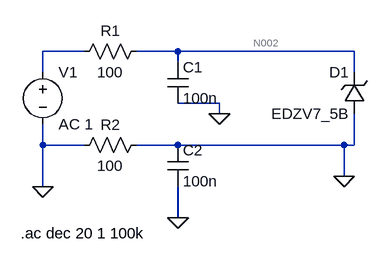
[diagram p0: schematic RC_Filter.asc]
* RC_Filter.asc
R1 N002 N001 100
R2 0 0 100
C1 N002 0 100n
C2 0 0 100n
V1 N001 0 AC 1
D1 0 N002 EDZV7_5B
.model D D
.lib standard.dio
.ac dec 20 1 100k
.backanno
.end

* Results of the author's LTspice run, read from the files saved beside the schematic
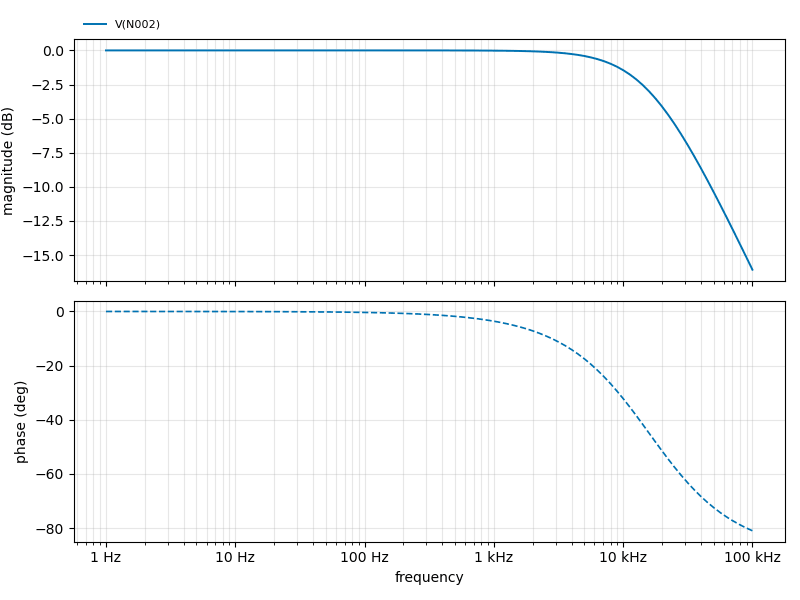
[diagram p1: AC Analysis of RC_Filter.asc, plotted from the saved traces]
* AC Analysis, 1 run:
*   V(N002): -0.00 dB at 1 Hz, -16.07 dB at 100 kHz, peak -0.00 dB at 1 Hz, 3 dB below the peak at 15.91 kHz